# Altium project MASTER.PRJPCB
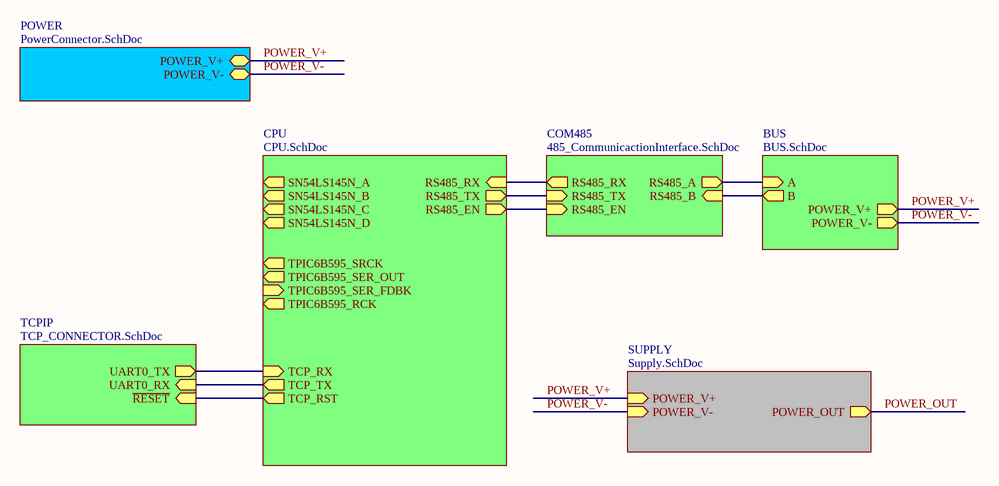
[diagram p0: Master.SchDoc]
8 sheets, 51 parts. Net scope: hierarchical (ports join the sheet entries above them; power ports are global).
Board file: BAZ-FOREXCTRL-01R03.PcbDoc
Sheets:
  Master.SchDoc
    CPU = CPU.SchDoc
    COM485 = 485_CommunicactionInterface.SchDoc
    BUS = BUS.SchDoc
      BUS = BUSConnector.SchDoc
      BUS = BUSConnector.SchDoc
    SUPPLY = Supply.SchDoc
    TCPIP = TCP_CONNECTOR.SchDoc
    POWER = PowerConnector.SchDoc

## Sheet Master.SchDoc
size A4

### Sub-sheets
BUS = BUS.SchDoc: A (in), B (out), POWER_V+ (out), POWER_V- (out)
COM485 = 485_CommunicactionInterface.SchDoc: RS485_RX (out), RS485_TX (in), RS485_EN (in), RS485_A (out), RS485_B (in)
CPU = CPU.SchDoc: RS485_RX (in), RS485_TX (out), RS485_EN (out), TPIC6B595_SER_FDBK (in), TPIC6B595_SRCK (out), TPIC6B595_SER_OUT (out), TPIC6B595_RCK (out), SN54LS145N_A (out), SN54LS145N_B (out), SN54LS145N_C (out), SN54LS145N_D (out), TCP_RX (in), TCP_TX (out), TCP_RST (out)
POWER = PowerConnector.SchDoc: POWER_V+, POWER_V-
SUPPLY = Supply.SchDoc: POWER_V+ (in), POWER_V- (in), POWER_OUT (out)
TCPIP = TCP_CONNECTOR.SchDoc: UART0_RX (in), UART0_TX (out), ~{RESET} (in)

### Nets
A: sheet COM485/RS485_A, sheet BUS/A
B: sheet COM485/RS485_B, sheet BUS/B
COM_485_EN: sheet CPU/RS485_EN, sheet COM485/RS485_EN
DI: sheet CPU/RS485_TX, sheet COM485/RS485_TX
POWER_V+: sheet BUS/POWER_V+, sheet SUPPLY/POWER_V+, sheet POWER/POWER_V+
POWER_V-: sheet BUS/POWER_V-, sheet SUPPLY/POWER_V-, sheet POWER/POWER_V-
RESET_A: sheet CPU/TCP_RST, sheet TCPIP/~{RESET}
RO: sheet CPU/RS485_RX, sheet COM485/RS485_RX
UART0_RX_A: sheet CPU/TCP_TX, sheet TCPIP/UART0_RX
UART0_TX_Y: sheet CPU/TCP_RX, sheet TCPIP/UART0_TX

## Sheet CPU.SchDoc
size A4
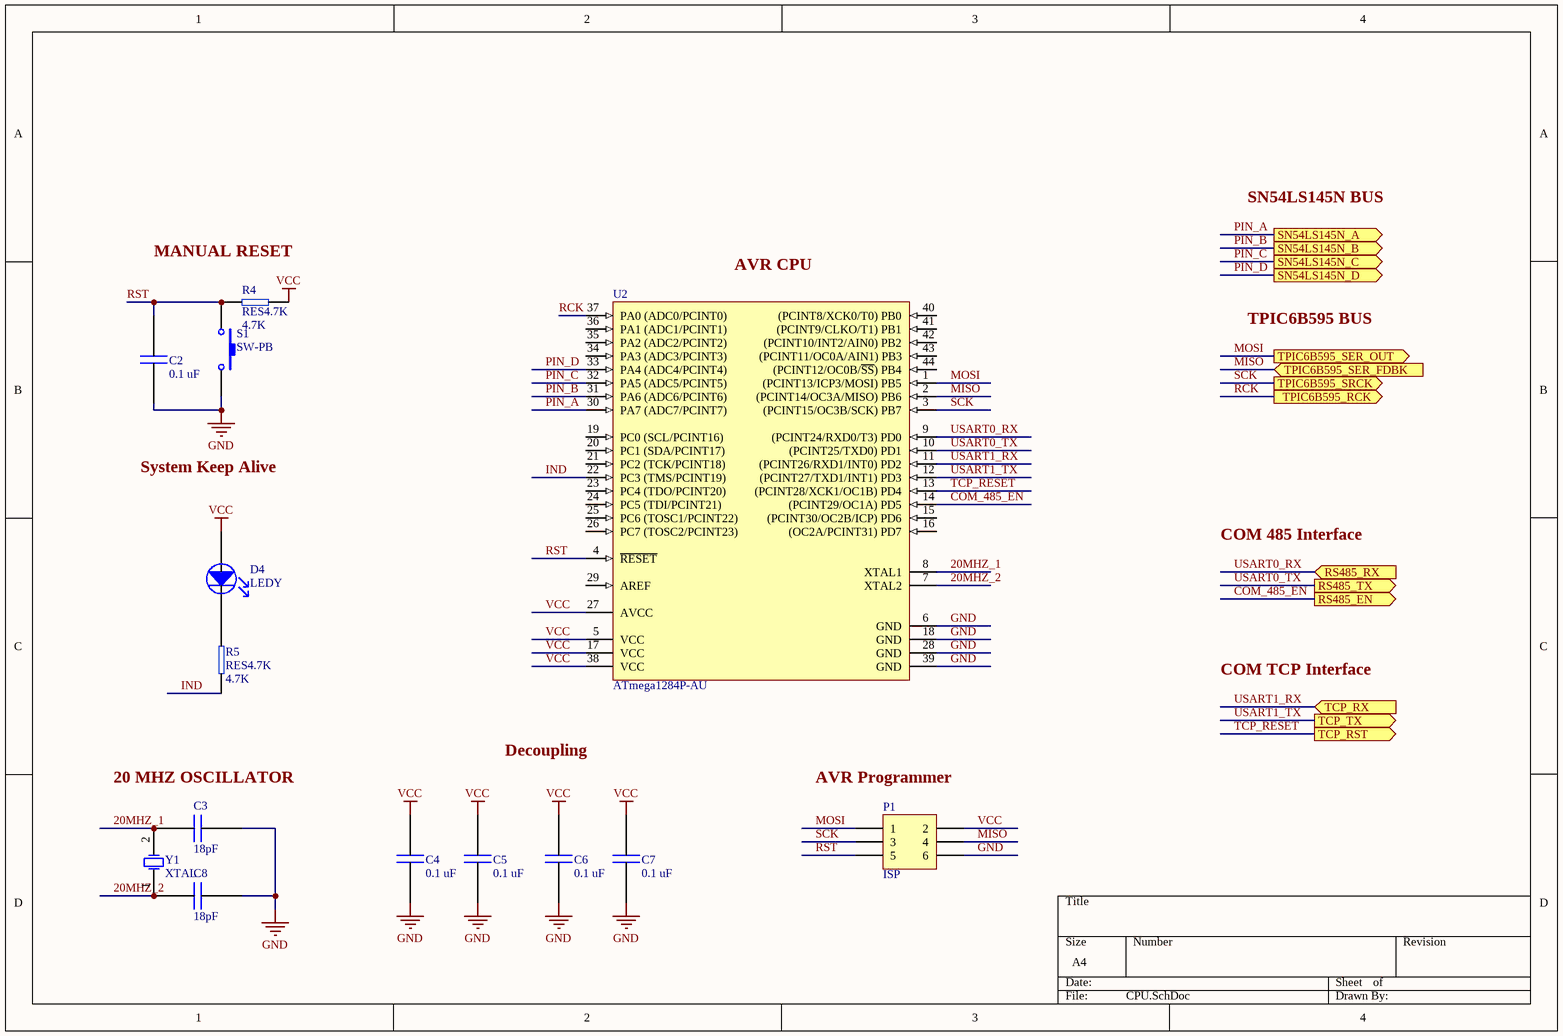
[diagram p1: CPU.SchDoc]

### Parts
C2  value 0.1 uF  [CAP0603]  (hidden comment: CAP0.1uF)
C3  value 18pF  [CAP0603]  (hidden comment: CAP18pF)
C4  value 0.1 uF  [CAP0603]  (hidden comment: CAP0.1uF)
C5  value 0.1 uF  [CAP0603]  (hidden comment: CAP0.1uF)
C6  value 0.1 uF  [CAP0603]  (hidden comment: CAP0.1uF)
C7  value 0.1 uF  [CAP0603]  (hidden comment: CAP0.1uF)
C8  value 18pF  [CAP0603]  (hidden comment: CAP18pF)
D4  LEDY  [150060YS75000]
P1  ISP  [HDR2X3]
R4  RES4.7K  value 4.7K  [RES0603]
R5  RES4.7K  value 4.7K  [RES0603]
S1  SW-PB  [microswitch]
U2  ATmega1284P-AU  [44A_N]
Y1  XTAL  [Crystal20MHz]

### Ports
RS485_EN (out), RS485_RX (in), RS485_TX (out), SN54LS145N_A (out), SN54LS145N_B (out), SN54LS145N_C (out), SN54LS145N_D (out), TCP_RST (out), TCP_RX (in), TCP_TX (out), TPIC6B595_RCK (out), TPIC6B595_SER_FDBK (in), TPIC6B595_SER_OUT (out), TPIC6B595_SRCK (out)

### Nets
GND: C2.2 C3.2 C4.2 C5.2 C6.2 C7.2 C8.2 P1.6 S1.2 U2.6(GND) U2.18(GND) U2.28(GND) U2.39(GND)
VCC: C4.1 C5.1 C6.1 C7.1 D4.2(Anode) P1.2 R4.2(neg) U2.5(VCC) U2.17(VCC) U2.27(AVCC) U2.38(VCC)
20MHZ_1: C3.1 U2.8(XTAL1) Y1.2(OSC2)
20MHZ_2: C8.1 U2.7(XTAL2) Y1.1(OSC1)
COM_485_EN: U2.14((PCINT29/OC1A)_PD5) ; port RS485_EN
IND: R5.1(pos) U2.22(PC3_(TMS/PCINT19))
MISO: P1.4 U2.2((PCINT14/OC3A/MISO)_PB6) ; port TPIC6B595_SER_FDBK
MOSI: P1.1 U2.1((PCINT13/ICP3/MOSI)_PB5) ; port TPIC6B595_SER_OUT
PIN_A: U2.30(PA7_(ADC7/PCINT7)) ; port SN54LS145N_A
PIN_B: U2.31(PA6_(ADC6/PCINT6)) ; port SN54LS145N_B
PIN_C: U2.32(PA5_(ADC5/PCINT5)) ; port SN54LS145N_C
PIN_D: U2.33(PA4_(ADC4/PCINT4)) ; port SN54LS145N_D
RCK: U2.37(PA0_(ADC0/PCINT0)) ; port TPIC6B595_RCK
RST: C2.1 P1.5 R4.1(pos) S1.1 U2.4(~{RESET})
SCK: P1.3 U2.3((PCINT15/OC3B/SCK)_PB7) ; port TPIC6B595_SRCK
TCP_RESET: U2.13((PCINT28/XCK1/OC1B)_PD4) ; port TCP_RST  [project net RESET_A]
USART0_RX: U2.9((PCINT24/RXD0/T3)_PD0) ; port RS485_RX  [project net RO]
USART0_TX: U2.10((PCINT25/TXD0)_PD1) ; port RS485_TX  [project net DI]
USART1_RX: U2.11((PCINT26/RXD1/INT0)_PD2) ; port TCP_RX  [project net UART0_TX_Y]
USART1_TX: U2.12((PCINT27/TXD1/INT1)_PD3) ; port TCP_TX  [project net UART0_RX_A]
NetD4_1: D4.1(Cathode) R5.2(neg)

Not connected (* = marked no-connect by the designer): U2 15((PCINT30/OC2B/ICP)_PD6) 16((OC2A/PCINT31)_PD7) 19(PC0_(SCL/PCINT16)) 20(PC1_(SDA/PCINT17)) 21(PC2_(TCK/PCINT18)) 23(PC4_(TDO/PCINT20)) 24(PC5_(TDI/PCINT21)) 25(PC6_(TOSC1/PCINT22)) 26(PC7_(TOSC2/PCINT23)) 29(AREF) 34(PA3_(ADC3/PCINT3)) 35(PA2_(ADC2/PCINT2)) 36(PA1_(ADC1/PCINT1)) 40((PCINT8/XCK0/T0)_PB0) 41((PCINT9/CLKO/T1)_PB1) 42((PCINT10/INT2/AIN0)_PB2) 43((PCINT11/OC0A/AIN1)_PB3) 44((PCINT12/OC0B/~{SS})_PB4)

### Notes on the sheet
- Labels drawn without touching a wire or pin: 20 MHZ OSCILLATOR, AVR CPU, AVR Programmer, COM 485 Interface, COM TCP Interface, Decoupling, MANUAL RESET, SN54LS145N BUS, System Keep Alive, TPIC6B595 BUS

### Library data of the parts
C2 C4-C7 = C0.1UF: Capacitores cerámicos de capas múltiples (MLCC) - SMD/SMT 0603 0.1uF 16volts X7R 5%; MPN: VJ0603Y104JXJPW1BC; Supplier PN: 77-VJ0603Y104JXJPBC; Supplier: Mouser
C3 C8 = CAP18pF: Capacitores cerámicos de capas múltiples (MLCC) - SMD/SMT 0603 18pF 50volts C0G 5%; MPN: GRM1885C1H180JA01D; Supplier: Mouser; Supplier PN: 81-GRM39C180J50
D4 = LEDY: LED estándar - SMD (montaje superficial) WL-SMCW SMDMono TpVw Waterclr 0603 Yellow; Supplier: Mouser; Supplier PN: 710-150060YS75000; MPN: 150060YS75000; Value: Yellow
P1 = Header 3X2: Alojamientos de cables y cabecera 2X03P DUAL ROW; MPN: 826925-3; Value: 6 POS; Supplier: Mouser; Supplier PN: 571-826925-3
R4 R5 = RES4.7K: Resistores de película gruesa - SMD 1/10watt 4.7Kohms 1%; MPN: CRCW06034K70FKEA; Supplier PN: 71-CRCW0603-4.7K-E3; Supplier: Mouser
S1 = SW-PB: Switch; MPN: PTS635SL43SMTR LFS; Value: OFF - (ON); Supplier: Mouser; Supplier PN: 611-PTS635SL43SMTRLF
U2 = ATmega1284P-AU: 20 MHz 8-bit AVR Microcontroller with 128KB Flash, 44-Pin TQFP Pkg, Industrial Temp; Supplier: Mouser; Supplier PN: 556-ATMEGA1284P-AU; MPN: ATMEGA1284P-AU; Value: ATMEGA1284P
Y1 = XTAL: Cristales 20MHz 16pF -10C +70C; MPN: ECS-200-16-5PX-TR; Supplier: Mouser; Supplier PN: 520-ECS-200-16-5PX-T; Value: 20 MHz

## Sheet 485_CommunicactionInterface.SchDoc
size A4
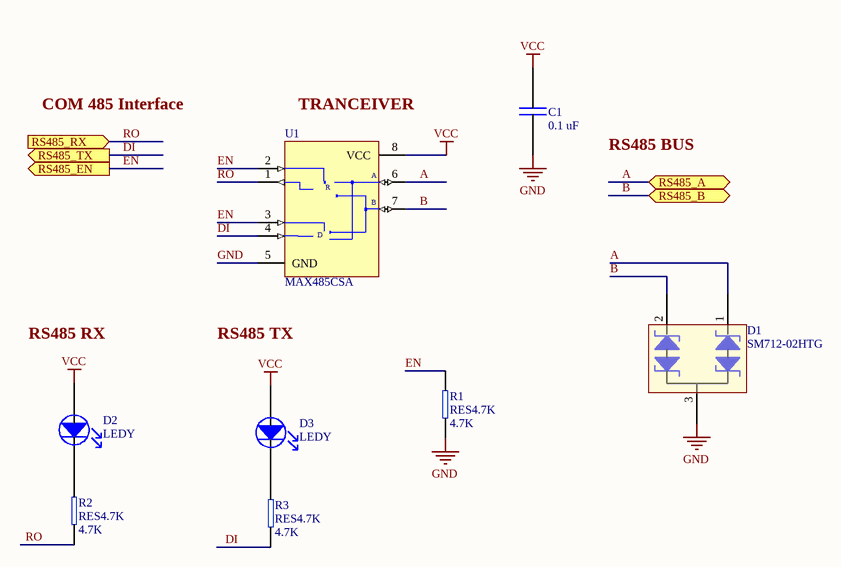
[diagram p2: 485_CommunicactionInterface.SchDoc]

### Parts
C1  value 0.1 uF  [CAP0603]  (hidden comment: CAP0.1uF)
D1  SM712-02HTG  [SW712]
D2  LEDY  [150060YS75000]
D3  LEDY  [150060YS75000]
R1  RES4.7K  value 4.7K  [RES0603]
R2  RES4.7K  value 4.7K  [RES0603]
R3  RES4.7K  value 4.7K  [RES0603]
U1  MAX485CSA  [NSO8_N]

### Ports
RS485_A (bidir), RS485_B (bidir), RS485_EN (out), RS485_RX (in), RS485_TX (out)

### Nets
GND: C1.2 D1.3 R1.2(neg) U1.5(GND)
VCC: C1.1 D2.2(Anode) D3.2(Anode) U1.8(VCC)
A: D1.1 U1.6(A) ; port RS485_A
B: D1.2 U1.7(B) ; port RS485_B
DI: R3.2(neg) U1.4(DI) ; port RS485_TX
EN: R1.1(pos) U1.2(~{RE}) U1.3(DE) ; port RS485_EN  [project net COM_485_EN]
RO: R2.2(neg) U1.1(RO) ; port RS485_RX
NetD2_1: D2.1(Cathode) R2.1(pos)
NetD3_1: D3.1(Cathode) R3.1(pos)

### Notes on the sheet
- Labels drawn without touching a wire or pin: COM 485 Interface, RS485 BUS, RS485 RX, RS485 TX, TRANCEIVER
- (in symbol MAX485CSA) R; D

### Library data of the parts
C1 = C0.1UF: as C2 on sheet CPU; Supplier PN: 77-VJ0603Y104JXJPBC; Supplier: Mouser
D1 = SM712-02HTG: Secuencias de diodos de TVS 600W 2 Channel Green Asymmetrical SOT23-3 (- 7 V to + 12 V); Supplier: Mouser; Supplier PN: 576-SM712-02HTG; MPN: SM712-02HTG; Value: TVS 600W
D2 D3 = LEDY: as D4 on sheet CPU; Supplier: Mouser; Supplier PN: 710-150060YS75000; MPN: 150060YS75000; Value: Yellow
R1-R3 = RES4.7K: as R4 on sheet CPU; Supplier PN: 71-CRCW0603-4.7K-E3; Supplier: Mouser
U1 = MAX485CSA: Low-Power, Slew-Rate-Limited RS-485/RS-422 Transceiver; MPN: MAX485CSA+; Value: RS485; Supplier: Mouser; Supplier PN: 700-MAX485CSA

## Sheet BUS.SchDoc
size A4
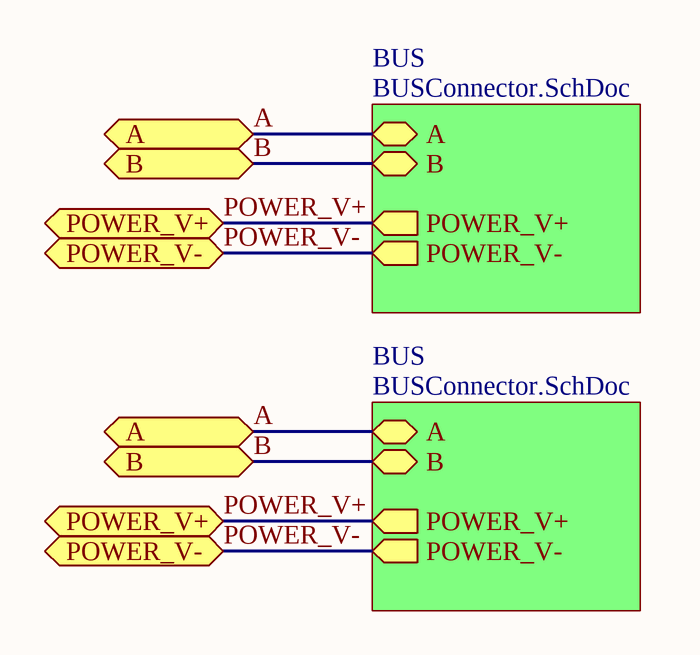
[diagram p3: BUS.SchDoc]

### Sub-sheets
BUS = BUSConnector.SchDoc: A (bidir), B (bidir), POWER_V+ (out), POWER_V- (out)
BUS = BUSConnector.SchDoc: A (bidir), B (bidir), POWER_V+ (out), POWER_V- (out)

### Ports
A, B, POWER_V+, POWER_V-

### Nets
A: port A, sheet BUS/A, sheet BUS/A
B: port B, sheet BUS/B, sheet BUS/B
POWER_V+: port POWER_V+, sheet BUS/POWER_V+, sheet BUS/POWER_V+
POWER_V-: port POWER_V-, sheet BUS/POWER_V-, sheet BUS/POWER_V-

## Sheet BUSConnector.SchDoc
size A4
Used 2 times, as channels BUS/BUS, BUS/BUS. Parts and nets are listed once, with the designators drawn on the sheet.
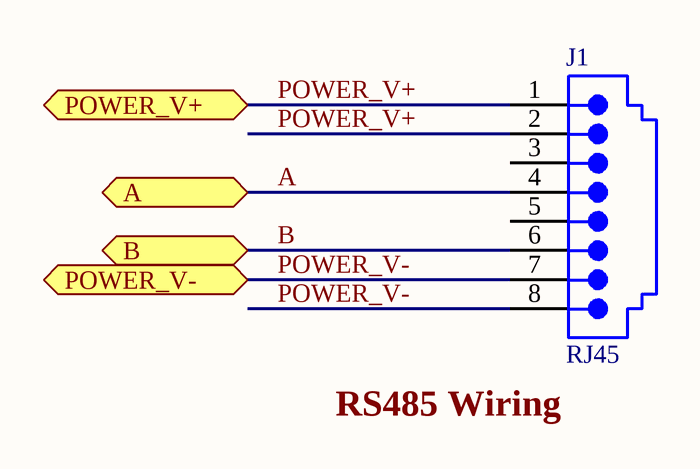
[diagram p4: BUSConnector.SchDoc]

### Parts
J1  RJ45  [15-43-6233]

### Ports
A, B, POWER_V+, POWER_V-

### Nets
A: J1.4 ; port A
B: J1.6 ; port B
POWER_V+: J1.1 J1.2 ; port POWER_V+
POWER_V-: J1.7 J1.8 ; port POWER_V-

Not connected (* = marked no-connect by the designer): J1 3 5

### Channels
BUS/BUS: designators end in _BUS3; ports A=A B=B POWER_V+=POWER_V+ POWER_V-=POWER_V-
BUS/BUS: designators end in _BUS2; ports A=A B=B POWER_V+=POWER_V+ POWER_V-=POWER_V-

### Notes on the sheet
- Labels drawn without touching a wire or pin: RS485 Wiring

### Library data of the parts
J1 = 15-43-6233: Conectores modulares / Conectores Ethernet 8 PCB LO PRO R/A; MPN: 5555164-1; Supplier: Mouser; Supplier PN: 571-5555164-1; Value: RJ45

## Sheet Supply.SchDoc
size A4
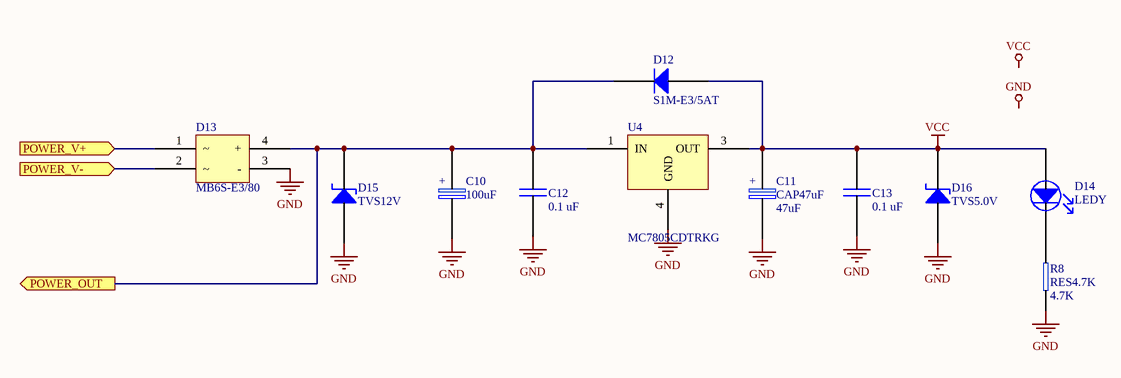
[diagram p5: Supply.SchDoc]

### Parts
C10  value 100uF  [EEH-ZA1E101XP]  (hidden comment: CAP100uF)
C11  CAP47uF  value 47uF  [EEH-ZA1E101XP]
C12  value 0.1 uF  [CAP0603]  (hidden comment: CAP0.1uF)
C13  value 0.1 uF  [CAP0603]  (hidden comment: CAP0.1uF)
D12  S1M-E3/5AT  [S1M-E3/5AT]
D13  MB6S-E3/80  [MB6S-E3/80]
D14  LEDY  [150060YS75000]
D15  TVS12V  [SMBJ5.0A]
D16  TVS5.0V  [SMBJ5.0A]
R8  RES4.7K  value 4.7K  [RES0603]
U4  MC7805CDTRKG  [MC7805CDTRKG]

### Ports
POWER_OUT (out), POWER_V+ (in), POWER_V- (in)

### Nets
GND: C10.2(neg) C11.2(neg) C12.2 C13.2 D13.3(-) D15.2(Anode) D16.2(Anode) R8.2(neg) U4.4(GND)
VCC: C11.1(pos) C13.1 D12.2(Anode) D14.2(Anode) D16.1(Cathode) U4.3(OUT)
POWER_OUT: C10.1(pos) C12.1 D12.1(Cathode) D13.4(+) D15.1(Cathode) U4.1(IN) ; port POWER_OUT
POWER_V+: D13.1 ; port POWER_V+
POWER_V-: D13.2 ; port POWER_V-
NetD14_1: D14.1(Cathode) R8.1(pos)

### Notes on the sheet
- Labels drawn without touching a wire or pin: GND, VCC
- (in symbol CAP47uF) +
- (in symbol CAP100uF) +

### Library data of the parts
C10 = CAP100uF: Capacitores de polímero orgánico de aluminio 100uF 25volts 6.3x7.7mm; Supplier: Mouser; Supplier PN: 667-EEH-ZA1E101XP; MPN: EEH-ZA1E101XP
C11 = CAP47uF: Capacitores de polímero orgánico de aluminio 25volts 47uF ESR 30mohm; MPN: 25SVPF47M; Supplier: Mouser; Supplier PN: 667-25SVPF47M
C12 C13 = C0.1UF: as C2 on sheet CPU; Supplier PN: 77-VJ0603Y104JXJPBC; Supplier: Mouser
D12 = S1M-E3/5AT: Rectificadores 1.0 Amp 1000 Volt 30A IFSM @ 8.3ms; Value: 1A; Supplier: Mouser; Supplier PN: 625-S1M-E3/5AT; MPN: S1M-E3/5AT
D13 = MB6S-E3/80: Rectificadores en puente 600 Volt 0.5 Amp 35 Amp IFSM; Value: 35V / 1A; MPN: MB6S-E3/80; Supplier: Mouser; Supplier PN: 625-MB6S-E3/80
D14 = LEDY: as D4 on sheet CPU; Supplier: Mouser; Supplier PN: 710-150060YS75000; MPN: 150060YS75000; Value: Yellow
D15 = TVS12V: Diodos TVS - Supresores de tensión transitoria 600W 12V 5% Uni; MPN: SMBJ12A-E3/52; Supplier: Mouser; Supplier PN: 625-SMBJ12A-E3; Value: 12 V
D16 = TVS5.0V: Diodos TVS - Supresores de tensión transitoria 5Vr 600W 65.3A 5% UniDirectional; Value: 5.0 V; Supplier: Mouser; Supplier PN: 576-SMBJ5.0A; MPN: SMBJ5.0A
R8 = RES4.7K: as R4 on sheet CPU; Supplier PN: 71-CRCW0603-4.7K-E3; Supplier: Mouser
U4 = MC7805CDTRKG: Reguladores de tensión lineal 5V 1A Postive; Value: 5.0 V / 1.0 A; Supplier: Mouser; Supplier PN: 863-MC7805CDTRKG; MPN: MC7805CDTRKG

## Sheet TCP_CONNECTOR.SchDoc
size A4
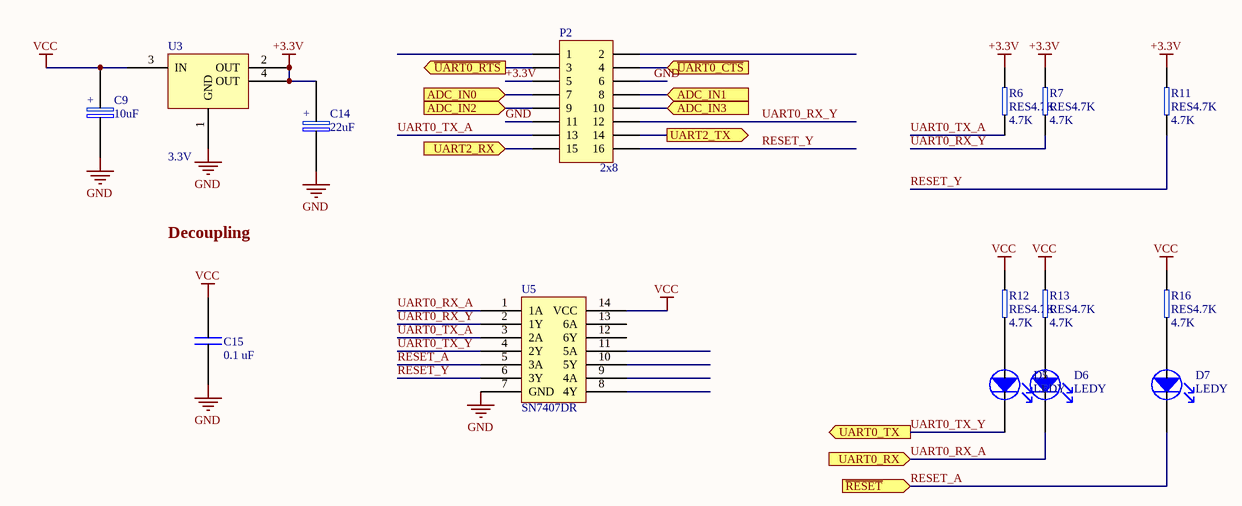
[diagram p6: TCP_CONNECTOR.SchDoc]

### Parts
C9  value 10uF  [CAP0805]  (hidden comment: CAP10uF)
C14  value 22uF  [CAP0805]  (hidden comment: CAP22uF)
C15  value 0.1 uF  [CAP0603]  (hidden comment: CAP0.1uF)
D5  LEDY  [150060YS75000]
D6  LEDY  [150060YS75000]
D7  LEDY  [150060YS75000]
P2  value 2x8  [HDR2X8]  (hidden comment: 826925-8)
R6  RES4.7K  value 4.7K  [RES0603]
R7  RES4.7K  value 4.7K  [RES0603]
R11  RES4.7K  value 4.7K  [RES0603]
R12  RES4.7K  value 4.7K  [RES0603]
R13  RES4.7K  value 4.7K  [RES0603]
R16  RES4.7K  value 4.7K  [RES0603]
U3  value 3.3V  [AZ1117H-3.3TRE1]  (hidden comment: AZ1117H-3.3TRE1)
U5  SN7407DR  [SOIC14]

### Ports
ADC_IN0 (in), ADC_IN1 (in), ADC_IN2 (in), ADC_IN3 (in), UART0_RX (in), UART0_TX (out), UART2_RX (in), UART2_TX (out), ~{RESET} (in), ~{UART0_CTS} (in), ~{UART0_RTS} (out)

### Nets
+3.3V: C14.1(pos) P2.5 R6.1(pos) R7.1(pos) R11.1(pos) U3.2(OUT) U3.4(OUT)
GND: C9.2(neg) C14.2(neg) C15.2 P2.6 P2.11 U3.1(GND) U5.7(GND)
VCC: C9.1(pos) C15.1 R12.1(pos) R13.1(pos) R16.1(pos) U3.3(IN) U5.14(VCC)
RESET_A: D7.1(Cathode) U5.5(3A) ; port ~{RESET}
RESET_Y: P2.16 R11.2(neg) U5.6(3Y)
UART0_RX_A: D6.1(Cathode) U5.1(1A) ; port UART0_RX
UART0_RX_Y: P2.12 R7.2(neg) U5.2(1Y)
UART0_TX_A: P2.13 R6.2(neg) U5.3(2A)
UART0_TX_Y: D5.1(Cathode) U5.4(2Y) ; port UART0_TX
NetD5_2: D5.2(Anode) R12.2(neg)
NetD6_2: D6.2(Anode) R13.2(neg)
NetD7_2: D7.2(Anode) R16.2(neg)
NetP2_3: P2.3 ; port ~{UART0_RTS}
NetP2_4: P2.4 ; port ~{UART0_CTS}
NetP2_7: P2.7 ; port ADC_IN0
NetP2_8: P2.8 ; port ADC_IN1
NetP2_9: P2.9 ; port ADC_IN2
NetP2_10: P2.10 ; port ADC_IN3
NetP2_14: P2.14 ; port UART2_TX
NetP2_15: P2.15 ; port UART2_RX

Not connected (* = marked no-connect by the designer): P2 1 2; U5 8(4Y) 9(4A) 10(5Y) 11(5A) 12(6Y) 13(6A)

### Notes on the sheet
- Labels drawn without touching a wire or pin: Decoupling
- (in symbol CAP10uF) +
- (in symbol CAP22uF) +

### Library data of the parts
C9 = CAP10uF: Capacitores cerámicos de capas múltiples (MLCC) - SMD/SMT 0805 10uF 16volts X5R 10%; MPN: GRM21BR61C106KE15L; Supplier: Mouser; Supplier PN: 81-GRM21BR61C106KE15
C14 = CAP22uF: Capacitores cerámicos de capas múltiples (MLCC) - SMD/SMT 0805 22uF 16volts X5R 20%; MPN: GRM21BR61C226ME44L; Supplier: Mouser; Supplier PN: 81-GRM21BR61C226ME4L
C15 = C0.1UF: as C2 on sheet CPU; Supplier PN: 77-VJ0603Y104JXJPBC; Supplier: Mouser
D5-D7 = LEDY: as D4 on sheet CPU; Supplier: Mouser; Supplier PN: 710-150060YS75000; MPN: 150060YS75000; Value: Yellow
P2 = Header 8X2: Alojamientos de cables y cabecera 2X08 POS VERT TIN; Supplier: Mouser; Supplier PN: 571-826925-8; MPN: 826925-8
R6 R7 R11-R13 R16 = RES4.7K: as R4 on sheet CPU; Supplier PN: 71-CRCW0603-4.7K-E3; Supplier: Mouser
U3 = AZ1117H-3.3TRE1: Reguladores de tensión lineal LDO BJT HiCurr 1.15V at 1A; Supplier: Mouser; Supplier PN: 621-AZ1117H-3.3TRE1; MPN: AZ1117H-3.3TRE1
U5 = SN7407DR: Búfers y controladores de línea Hex Buffer/Driver; Value: Hex Budder/Driver; Supplier: Mouser; Supplier PN: 595-SN7407DR; MPN: SN7407DR

## Sheet PowerConnector.SchDoc
size A4
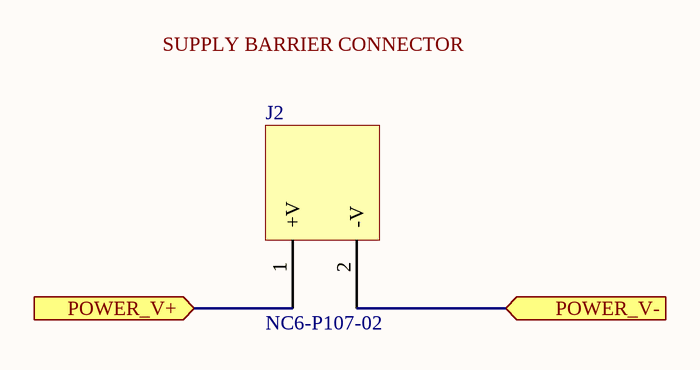
[diagram p7: PowerConnector.SchDoc]

### Parts
J2  NC6-P107-02  [Barrier2POS]

### Ports
POWER_V+ (in), POWER_V- (in)

### Nets
POWER_V+: J2.1(+V) ; port POWER_V+
POWER_V-: J2.2(-V) ; port POWER_V-

### Notes on the sheet
- Labels drawn without touching a wire or pin: SUPPLY BARRIER CONNECTOR

### Library data of the parts
J2 = NC6-P107-02: Bloques de terminal de barrera DUAL .375" 2P 12-22; Value: 2 POS; Supplier: Mouser; Supplier PN: 571-14376644; MPN: NC6-P107-02

## Nets that join several sheets
GND: CPU (13 pins), 485_CommunicactionInterface (C1.2 D1.3 R1.2 U1.5), Supply (9 pins), TCP_CONNECTOR (7 pins)
VCC: CPU (11 pins), 485_CommunicactionInterface (C1.1 D2.2 D3.2 U1.8), Supply (6 pins), TCP_CONNECTOR (7 pins)
A: 485_CommunicactionInterface (D1.1 U1.6), BUS/BUS (J1_BUS3.4), BUS/BUS (J1_BUS2.4)
B: 485_CommunicactionInterface (D1.2 U1.7), BUS/BUS (J1_BUS3.6), BUS/BUS (J1_BUS2.6)
COM_485_EN: CPU (U2.14), 485_CommunicactionInterface (R1.1 U1.2 U1.3)
DI: CPU (U2.10), 485_CommunicactionInterface (R3.2 U1.4)
POWER_V+: BUS/BUS (J1_BUS3.1 J1_BUS3.2), BUS/BUS (J1_BUS2.1 J1_BUS2.2), Supply (D13.1), PowerConnector (J2.1)
POWER_V-: BUS/BUS (J1_BUS3.7 J1_BUS3.8), BUS/BUS (J1_BUS2.7 J1_BUS2.8), Supply (D13.2), PowerConnector (J2.2)
RESET_A: CPU (U2.13), TCP_CONNECTOR (D7.1 U5.5)
RO: CPU (U2.9), 485_CommunicactionInterface (R2.2 U1.1)
UART0_RX_A: CPU (U2.12), TCP_CONNECTOR (D6.1 U5.1)
UART0_TX_Y: CPU (U2.11), TCP_CONNECTOR (D5.1 U5.4)